# EAGLE schematic PIR_MOC_2 (EAGLE 6.5.0)
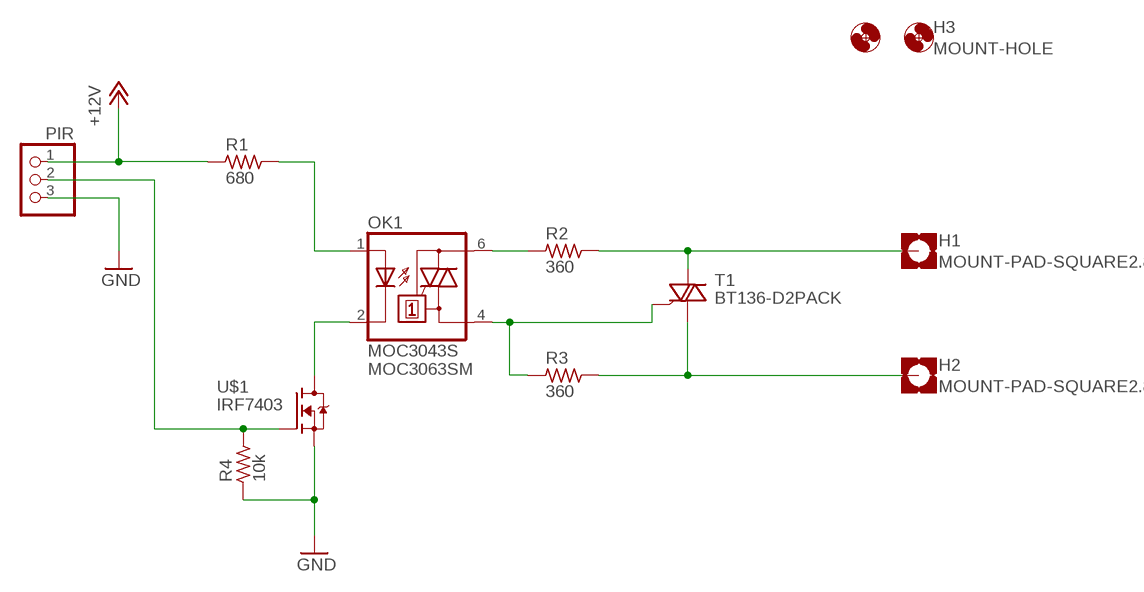
[diagram p0: schematic, sheet 1]

## Parts
H1  MOUNT-PAD-SQUARE2.8  [2,8-PAD-SQUARE]
H2  MOUNT-PAD-SQUARE2.8  [2,8-PAD-SQUARE]
H3  MOUNT-HOLE  [CASE_20-31_VHOLES]
OK1  MOC3043S  [DIL6-SMD]
PIR  PINHD-1X03_2.54-S  [1X03-S]
R1  680  R_1206  [R1206]
R2  360  R_1206  [R1206]
R3  360  R_1206  [R1206]
R4  10k  R_1206  [R1206]
T1  BT136-D2PACK  [TO263]
U$1  IRF7403  [SO-8]

## Nets
220_AC: H1.B2,8(MOUNT) R2.2 T1.3(A2)
220_MOC_AC: OK1.6(A2) R2.1
220_MOC_N: OK1.4(A1) R3.1 T1.2(G)
220_N: H2.B2,8(MOUNT) R3.2 T1.1(A1)
+12V: PIR.1 R1.1
GND: PIR.3 R4.1 U$1.1(S) U$1.2(S) U$1.3(S)
N$5: OK1.2(C) U$1.5(D) U$1.6(D) U$1.7(D) U$1.8(D)
N$6: OK1.1(A) R1.2
N$7: PIR.2 R4.2 U$1.4(G)

## Library data of the parts
H1 H2 = holes:MOUNT-PAD-SQUARE: MOUNTING PAD, square
H3 = my-library:MOUNT-HOLE: MOUNTING HOLE with drill center marker
OK1 = optocoupler:MOC30*: 6-Pin DIP Zero-Cross Optoisolators Triac Driver Output (250/400 Volt Peak) Source: Data sheet <http://www.fairchildsemi.com/ds/MO/MOC3031M.pdf> The old path of data sheet not more available 2013-05-06.; MF: FAIRCHILD SEMICONDUCTOR; MPN: MOC3063SM; OC_FARNELL: 1505441; OC_NEWARK: 78K6091
PIR = pinhead-2:PINHD-1X03: PIN HEADER
R1-R4 = rc-master-smd:R_: RESISTOR
T1 = my-library:BT136: Triac BT136 series E sensitive gate Source: http://www.nxp.com/acrobat_download/datasheets/BT136_SERIES_E_2.pdf
U$1 = my-library:IRF7403